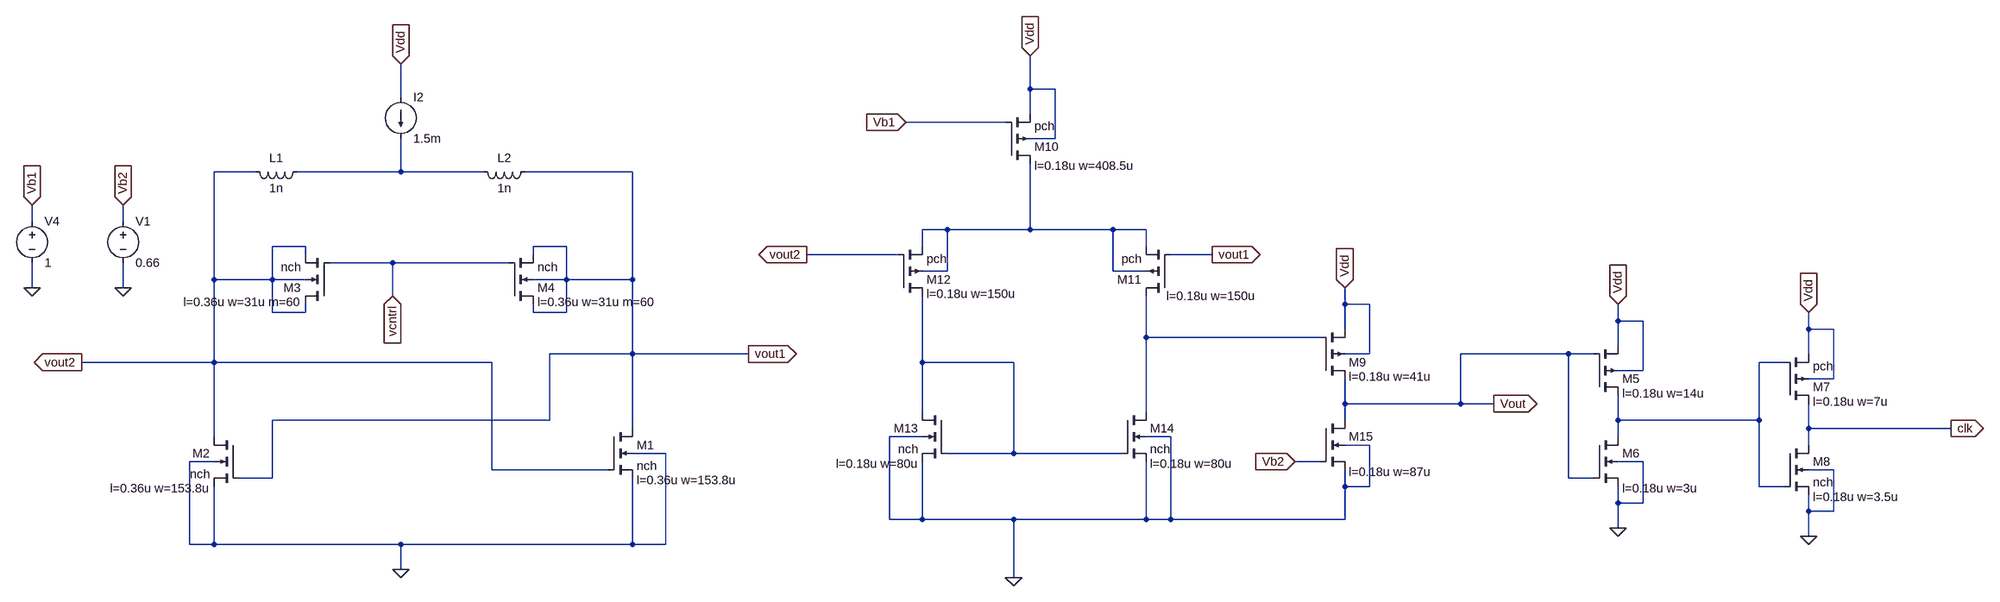
[diagram p0: schematic VCO_CLK.asc]
VCO_CLK.asc, the LTspice schematic file:
Version 4
SHEET 1 5428 1300
WIRE 1888 -656 1888 -720
WIRE 1936 -656 1888 -656
WIRE 672 -640 672 -704
WIRE 1888 -608 1888 -656
WIRE 1840 -592 1648 -592
WIRE 1936 -560 1936 -656
WIRE 1936 -560 1888 -560
WIRE 320 -496 240 -496
WIRE 672 -496 672 -560
WIRE 672 -496 400 -496
WIRE 832 -496 672 -496
WIRE 1120 -496 912 -496
WIRE -112 -400 -112 -432
WIRE 64 -400 64 -432
WIRE 1728 -384 1680 -384
WIRE 1888 -384 1888 -512
WIRE 1888 -384 1728 -384
WIRE 2048 -384 1888 -384
WIRE 2112 -384 2048 -384
WIRE 416 -352 352 -352
WIRE 992 -352 928 -352
WIRE 1680 -352 1680 -384
WIRE 2112 -352 2112 -384
WIRE 416 -336 416 -352
WIRE 928 -336 928 -352
WIRE 1632 -336 1456 -336
WIRE 2240 -336 2160 -336
WIRE 656 -320 464 -320
WIRE 880 -320 656 -320
WIRE 1728 -304 1728 -384
WIRE 1728 -304 1680 -304
WIRE 2048 -304 2048 -384
WIRE 2112 -304 2048 -304
WIRE 240 -288 240 -496
WIRE 352 -288 352 -352
WIRE 352 -288 240 -288
WIRE 416 -288 352 -288
WIRE 992 -288 992 -352
WIRE 992 -288 928 -288
WIRE 1120 -288 1120 -496
WIRE 1120 -288 992 -288
WIRE -112 -272 -112 -320
WIRE 64 -272 64 -320
WIRE 656 -256 656 -320
WIRE 2496 -240 2496 -272
WIRE 2544 -240 2496 -240
WIRE 352 -224 352 -288
WIRE 416 -224 416 -240
WIRE 416 -224 352 -224
WIRE 928 -224 928 -240
WIRE 992 -224 992 -288
WIRE 992 -224 928 -224
WIRE 3024 -208 3024 -240
WIRE 3072 -208 3024 -208
WIRE 2496 -192 2496 -240
WIRE 3424 -192 3424 -224
WIRE 3472 -192 3424 -192
WIRE 2112 -176 2112 -256
WIRE 2448 -176 2112 -176
WIRE 3024 -160 3024 -208
WIRE 1120 -144 1120 -288
WIRE 1120 -144 960 -144
WIRE 1344 -144 1120 -144
WIRE 2544 -144 2544 -240
WIRE 2544 -144 2496 -144
WIRE 2928 -144 2720 -144
WIRE 2976 -144 2928 -144
WIRE 3424 -144 3424 -192
WIRE 240 -128 240 -288
WIRE 240 -128 -16 -128
WIRE 848 -128 240 -128
WIRE 1680 -128 1680 -256
WIRE 1856 -128 1680 -128
WIRE 3376 -128 3328 -128
WIRE 3072 -112 3072 -208
WIRE 3072 -112 3024 -112
WIRE 3472 -96 3472 -192
WIRE 3472 -96 3424 -96
WIRE 2496 -48 2496 -96
WIRE 2720 -48 2720 -144
WIRE 2720 -48 2496 -48
WIRE 2784 -48 2720 -48
WIRE 1680 -32 1680 -128
WIRE 2112 -32 2112 -176
WIRE 960 -16 960 -144
WIRE 960 -16 352 -16
WIRE 2496 -16 2496 -48
WIRE 3024 -16 3024 -64
WIRE 3328 -16 3328 -128
WIRE 3328 -16 3024 -16
WIRE 1120 0 1120 -144
WIRE 3424 0 3424 -48
WIRE 3712 0 3424 0
WIRE 240 16 240 -128
WIRE 1680 16 1616 16
WIRE 2160 16 2112 16
WIRE 3024 16 3024 -16
WIRE 2544 32 2496 32
WIRE 3424 32 3424 0
WIRE 1184 48 1120 48
WIRE 1856 48 1856 -128
WIRE 1856 48 1728 48
WIRE 2064 48 1856 48
WIRE 240 64 192 64
WIRE 2448 64 2400 64
WIRE 3072 64 3024 64
WIRE 848 80 848 -128
WIRE 1072 80 848 80
WIRE 3472 80 3424 80
WIRE 352 96 352 -16
WIRE 352 96 288 96
WIRE 2928 96 2928 -144
WIRE 2976 96 2928 96
WIRE 2496 112 2496 80
WIRE 2544 112 2544 32
WIRE 2544 112 2496 112
WIRE 3328 112 3328 -16
WIRE 3376 112 3328 112
WIRE 3024 144 3024 112
WIRE 3072 144 3072 64
WIRE 3072 144 3024 144
WIRE 3424 160 3424 128
WIRE 3472 160 3472 80
WIRE 3472 160 3424 160
WIRE 1616 176 1616 16
WIRE 1680 176 1680 64
WIRE 1680 176 1616 176
WIRE 1856 176 1680 176
WIRE 2112 176 2112 64
WIRE 2112 176 1856 176
WIRE 2160 176 2160 16
WIRE 2160 176 2112 176
WIRE 2496 176 2496 112
WIRE 2496 176 2160 176
WIRE 3024 192 3024 144
WIRE 3424 208 3424 160
WIRE 192 224 192 64
WIRE 240 224 240 112
WIRE 240 224 192 224
WIRE 672 224 240 224
WIRE 1120 224 1120 96
WIRE 1120 224 672 224
WIRE 1184 224 1184 48
WIRE 1184 224 1120 224
WIRE 672 272 672 224
WIRE 1856 288 1856 176
FLAG 672 -704 Vdd
IOPIN 672 -704 In
FLAG 1344 -144 vout1
IOPIN 1344 -144 Out
FLAG 672 272 0
FLAG -16 -128 vout2
IOPIN -16 -128 Out
FLAG 656 -256 vcntrl
IOPIN 656 -256 In
FLAG 1856 288 0
FLAG -112 -272 0
FLAG 3024 192 0
FLAG 3424 208 0
FLAG 1888 -720 Vdd
IOPIN 1888 -720 In
FLAG 3024 -240 Vdd
IOPIN 3024 -240 In
FLAG 3424 -224 Vdd
IOPIN 3424 -224 In
FLAG 1456 -336 vout2
IOPIN 1456 -336 Out
FLAG 2496 -272 Vdd
IOPIN 2496 -272 In
FLAG 2240 -336 vout1
IOPIN 2240 -336 Out
FLAG 64 -272 0
FLAG -112 -432 Vb1
IOPIN -112 -432 In
FLAG 64 -432 Vb2
IOPIN 64 -432 In
FLAG 1648 -592 Vb1
IOPIN 1648 -592 In
FLAG 2400 64 Vb2
IOPIN 2400 64 In
FLAG 2784 -48 Vout
IOPIN 2784 -48 Out
FLAG 3712 0 clk
IOPIN 3712 0 Out
SYMBOL nmos4 288 16 M0
WINDOW 123 56 100 Left 2
SYMATTR Value2 l=0.36u w=153.8u
SYMATTR InstName M2
SYMATTR Value nch
SYMBOL current 672 -640 R0
WINDOW 123 0 0 Left 0
WINDOW 39 0 0 Left 0
SYMATTR InstName I2
SYMATTR Value 1.5m
SYMBOL ind 416 -512 R90
WINDOW 0 5 56 VBottom 2
WINDOW 3 32 56 VTop 2
SYMATTR InstName L1
SYMATTR Value 1n
SYMATTR SpiceLine Rser=1.5
SYMBOL nmos4 1072 0 R0
WINDOW 123 56 100 Left 2
SYMATTR Value2 l=0.36u w=153.8u
SYMATTR InstName M1
SYMATTR Value nch
SYMBOL ind 928 -512 R90
WINDOW 0 5 56 VBottom 2
WINDOW 3 32 56 VTop 2
SYMATTR InstName L2
SYMATTR Value 1n
SYMATTR SpiceLine Rser=1.5
SYMBOL nmos4 464 -240 R180
WINDOW 123 56 4 Left 2
SYMATTR Value2 l=0.36u w=31u m=60
SYMATTR InstName M3
SYMATTR Value nch
SYMBOL nmos4 880 -240 M180
WINDOW 123 56 4 Left 2
SYMATTR Value2 l=0.36u w=31u m=60
SYMATTR InstName M4
SYMATTR Value nch
SYMBOL pmos4 1840 -512 M180
WINDOW 123 56 -4 Left 2
SYMATTR Value2 l=0.18u w=408.5u
SYMATTR InstName M10
SYMATTR Value pch
SYMBOL pmos4 2160 -256 R180
WINDOW 123 -164 0 Left 2
SYMATTR Value2 l=0.18u w=150u
SYMATTR InstName M11
SYMATTR Value pch
SYMBOL pmos4 1632 -256 M180
WINDOW 123 56 4 Left 2
SYMATTR Value2 l=0.18u w=150u
SYMATTR InstName M12
SYMATTR Value pch
SYMBOL voltage -112 -416 R0
WINDOW 123 0 0 Left 0
WINDOW 39 0 0 Left 0
SYMATTR InstName V4
SYMATTR Value 1
SYMBOL nmos4 1728 -32 M0
WINDOW 123 56 100 Left 2
SYMATTR Value2 l=0.18u w=80u
SYMATTR InstName M13
SYMATTR Value nch
SYMBOL nmos4 2064 -32 R0
WINDOW 123 56 100 Left 2
SYMATTR Value2 l=0.18u w=80u
SYMATTR InstName M14
SYMATTR Value nch
SYMBOL pmos4 2976 -64 M180
WINDOW 123 56 4 Left 2
WINDOW 3 56 72 Invisible 2
SYMATTR Value2 l=0.18u w=14u
SYMATTR Value pch
SYMATTR InstName M5
SYMBOL nmos4 2976 16 R0
WINDOW 123 56 100 Left 2
WINDOW 3 56 72 Invisible 2
SYMATTR Value2 l=0.18u w=3u
SYMATTR Value nch
SYMATTR InstName M6
SYMBOL pmos4 3376 -48 M180
WINDOW 123 56 4 Left 2
SYMATTR Value2 l=0.18u w=7u
SYMATTR InstName M7
SYMATTR Value pch
SYMBOL nmos4 3376 32 R0
WINDOW 123 56 100 Left 2
SYMATTR Value2 l=0.18u w=3.5u
SYMATTR InstName M8
SYMATTR Value nch
SYMBOL pmos4 2448 -96 M180
WINDOW 123 56 4 Left 2
WINDOW 3 56 72 Invisible 2
SYMATTR Value2 l=0.18u w=41u
SYMATTR Value pch
SYMATTR InstName M9
SYMBOL nmos4 2448 -16 R0
WINDOW 123 56 100 Left 2
WINDOW 3 56 72 Invisible 2
SYMATTR Value2 l=0.18u w=87u
SYMATTR Value nch
SYMATTR InstName M15
SYMBOL voltage 64 -416 R0
WINDOW 123 0 0 Left 0
WINDOW 39 0 0 Left 0
SYMATTR InstName V1
SYMATTR Value 0.66

The netlist it stands for:
* VCO_CLK.asc
M2 vout2 vout1 0 0 nch l=0.36u w=153.8u
I2 Vdd N001 1.5m
L1 N001 vout2 1n Rser=1.5
M1 vout1 vout2 0 0 nch l=0.36u w=153.8u
L2 vout1 N001 1n Rser=1.5
M3 vout2 vcntrl vout2 vout2 nch l=0.36u w=31u m=60
M4 vout1 vcntrl vout1 vout1 nch l=0.36u w=31u m=60
M10 N002 Vb1 Vdd Vdd pch l=0.18u w=408.5u
M11 N003 vout1 N002 N002 pch l=0.18u w=150u
M12 N004 vout2 N002 N002 pch l=0.18u w=150u
V4 Vb1 0 1
M13 N004 N004 0 0 nch l=0.18u w=80u
M14 N003 N004 0 0 nch l=0.18u w=80u
M5 N005 Vout Vdd Vdd pch l=0.18u w=14u
M6 N005 Vout 0 0 nch l=0.18u w=3u
M7 clk N005 Vdd Vdd pch l=0.18u w=7u
M8 clk N005 0 0 nch l=0.18u w=3.5u
M9 Vout N003 Vdd Vdd pch l=0.18u w=41u
M15 Vout Vb2 0 0 nch l=0.18u w=87u
V1 Vb2 0 0.66
.model NMOS NMOS
.model PMOS PMOS
.lib standard.mos
.backanno
.end